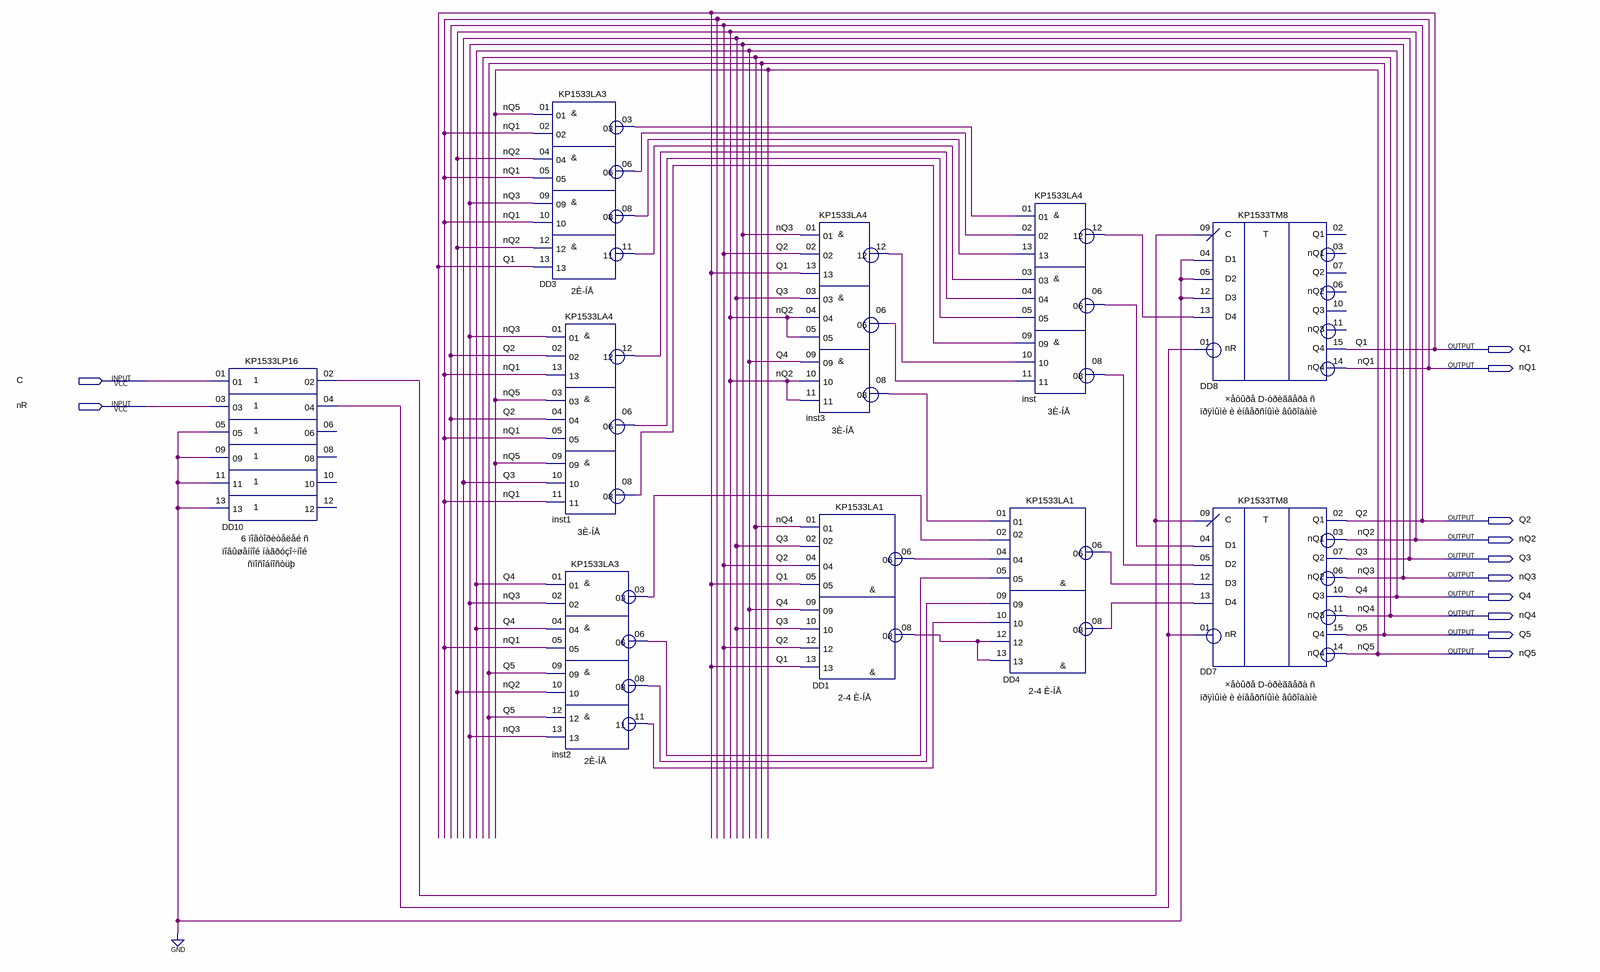
[diagram p0: schematic sheet]
// Quartus schematic _BinaryCounterDFF.bdf as structural Verilog: 10 symbols, 12 pins
module _BinaryCounterDFF (
  input  C,
  input  nR,
  output Q1,
  output nQ1,
  output Q2,
  output nQ2,
  output Q3,
  output nQ3,
  output Q4,
  output nQ4,
  output Q5,
  output nQ5
);

  wire DD1_06, DD1_08, DD3_03, DD3_06, DD3_08, DD3_11, DD4_06, DD4_08, DD10_02, DD10_04, inst1_06, inst1_08,
       inst1_12, inst2_03, inst2_06, inst2_08, inst2_11, inst3_06, inst3_08, inst3_12, inst_06, inst_08,
       inst_12;

  KP1533LP16 DD10 (
    .\01 (C), .\03 (nR), .\05 (1'b0), .\09 (1'b0), .\11 (1'b0), .\13 (1'b0), .\02 (DD10_02), .\04 (DD10_04));  // open: 06, 08, 10, 12
  KP1533LA3 DD3 (
    .\01 (nQ5), .\02 (nQ1), .\04 (nQ2), .\05 (nQ1), .\09 (nQ3), .\10 (nQ1), .\12 (nQ2), .\13 (Q1),
    .\03 (DD3_03), .\06 (DD3_06), .\08 (DD3_08), .\11 (DD3_11));
  KP1533LA4 inst1 (
    .\01 (nQ3), .\02 (Q2), .\13 (nQ1), .\03 (nQ5), .\04 (Q2), .\05 (nQ1), .\09 (nQ5), .\10 (Q3), .\11 (nQ1),
    .\12 (inst1_12), .\06 (inst1_06), .\08 (inst1_08));
  KP1533LA3 inst2 (
    .\01 (Q4), .\02 (nQ3), .\04 (Q4), .\05 (nQ1), .\09 (Q5), .\10 (nQ2), .\12 (Q5), .\13 (nQ3),
    .\03 (inst2_03), .\06 (inst2_06), .\08 (inst2_08), .\11 (inst2_11));
  KP1533LA4 inst3 (
    .\01 (nQ3), .\02 (Q2), .\13 (Q1), .\03 (Q3), .\04 (nQ2), .\05 (nQ2), .\09 (Q4), .\10 (nQ2), .\11 (nQ2),
    .\12 (inst3_12), .\06 (inst3_06), .\08 (inst3_08));
  KP1533LA1 DD1 (
    .\01 (nQ4), .\02 (Q3), .\04 (Q2), .\05 (Q1), .\09 (Q4), .\10 (Q3), .\12 (Q2), .\13 (Q1), .\06 (DD1_06),
    .\08 (DD1_08));
  KP1533LA1 DD4 (
    .\01 (inst3_08), .\02 (inst2_03), .\04 (DD1_06), .\05 (inst2_06), .\09 (inst2_08), .\10 (inst2_11),
    .\12 (DD1_08), .\13 (DD1_08), .\06 (DD4_06), .\08 (DD4_08));
  KP1533LA4 inst (
    .\01 (DD3_03), .\02 (DD3_06), .\13 (DD3_08), .\03 (DD3_11), .\04 (inst1_12), .\05 (inst1_06),
    .\09 (inst1_08), .\10 (inst3_12), .\11 (inst3_06), .\12 (inst_12), .\06 (inst_06), .\08 (inst_08));
  KP1533TM8 DD8 (
    .nR(DD10_04), .C(DD10_02), .D1(1'b0), .D2(1'b0), .D3(1'b0), .D4(inst_12), .Q4(Q1), .nQ4(nQ1));  // open: Q1, nQ1, Q2, nQ2, Q3, nQ3
  KP1533TM8 DD7 (
    .nR(DD10_04), .C(DD10_02), .D1(inst_06), .D2(inst_08), .D3(DD4_06), .D4(DD4_08), .Q1(Q2), .nQ1(nQ2),
    .Q2(Q3), .nQ2(nQ3), .Q3(Q4), .nQ3(nQ4), .Q4(Q5), .nQ4(nQ5));
endmodule
